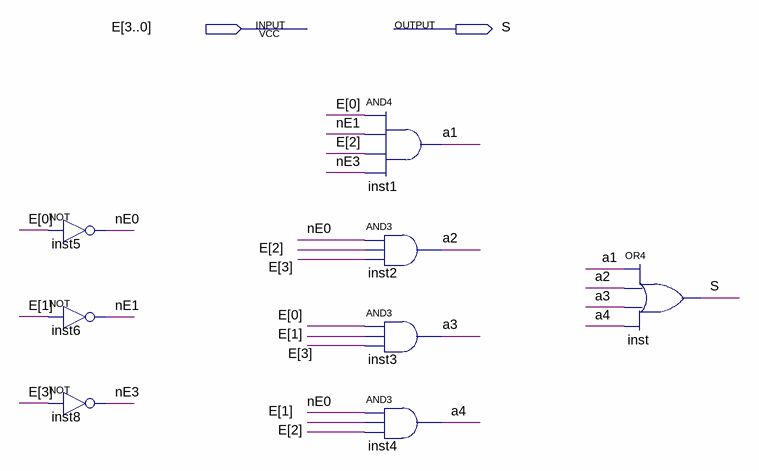
[diagram p0: schematic sheet]
// Quartus schematic B.bdf as structural Verilog: 8 symbols, 2 pins
module B (
  input  [3:0] E,
  output S
);

  wire a1, a2, a3, a4, nE0, nE1, nE3;

  not inst5 (nE0, E[0]);
  not inst6 (nE1, E[1]);
  not inst8 (nE3, E[3]);
  and inst1 (a1, E[0], nE1, E[2], nE3);
  and inst2 (a2, nE0, E[2], E[3]);
  and inst3 (a3, E[0], E[1], E[3]);
  and inst4 (a4, nE0, E[1], E[2]);
  or inst (S, a1, a2, a3, a4);
endmodule
